# EAGLE design BT_Controller (EAGLE 8.0.0)
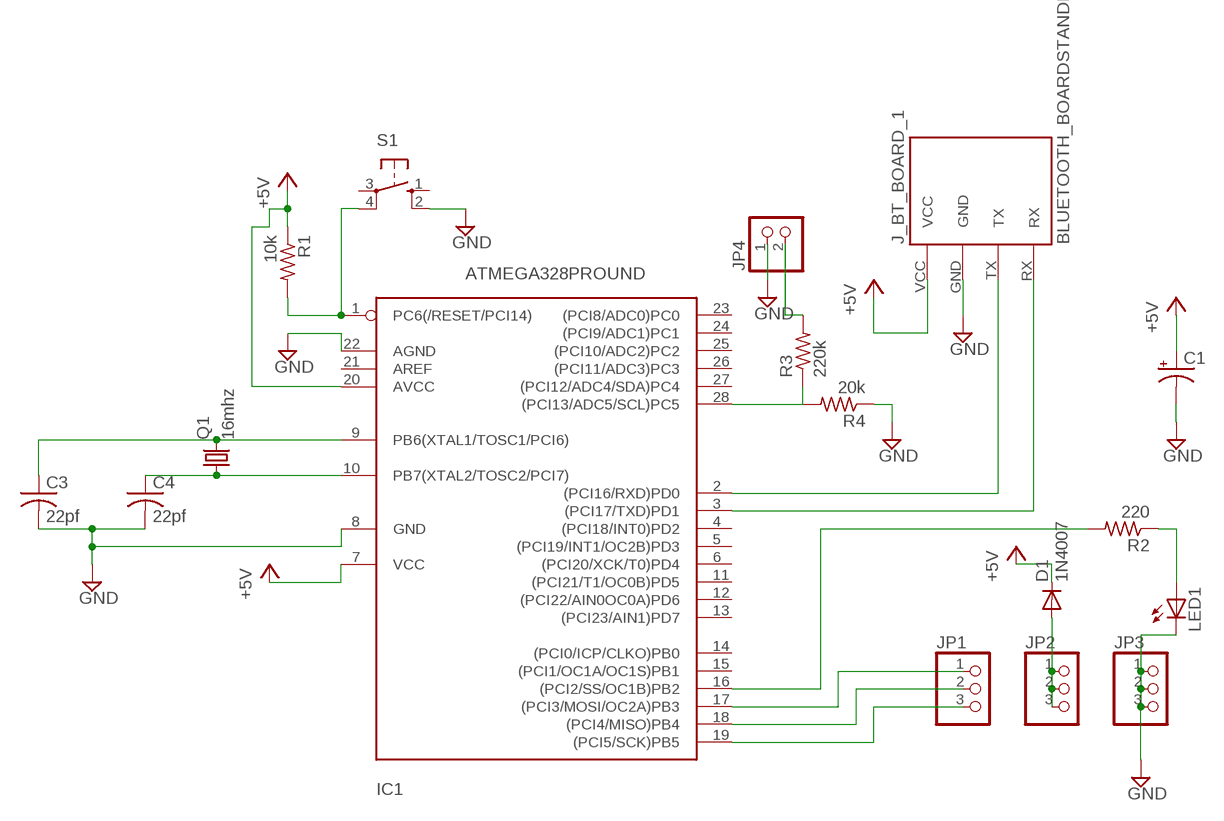
[diagram p0: schematic, sheet 1]

## Parts
C1  CPOL-USE2,5-6E  [E2,5-6E]
C3  22pf  C-US050-024X044  [C050-024X044]
C4  22pf  C-US050-024X044  [C050-024X044]
D1  1N4007  1N4004  [DO41-10]
IC1  ATMEGA328PROUND  [DIL28-3-ROUND]
J_BT_BOARD_1  BLUETOOTH_BOARDSTANDING  [BT_BOARD_FOOTPRINT_STANDING]
JP1  PINHD-1X3  [1X03]
JP2  PINHD-1X3  [1X03]
JP3  PINHD-1X3  [1X03]
JP4  PINHD-1X2  [1X02]
LED1  LED5MM  [LED5MM]
Q1  16mhz  CRYSTALHC49U70  [HC49U70]
R1  10k  R-US_0207/7  [0207/7]
R2  220  R-US_0207/7  [0207/7]
R3  220k  R-US_0207/7  [0207/7]
R4  20k  R-US_0207/7  [0207/7]
S1  10-XX  [B3F-10XX]

## Nets
+5V [supply]: C1.+ D1.C IC1.7(VCC) IC1.20(AVCC) J_BT_BOARD_1.VCC R1.1
GND [supply]: C1.- C3.2 C4.2 IC1.8(GND) IC1.22(AGND) J_BT_BOARD_1.GND JP3.1 JP3.2 JP3.3 JP4.1 LED1.K(C) R4.1 S1.2(S1)
N$1: C3.1 IC1.9(PB6(XTAL1/TOSC1/PCI6)) Q1.2
N$2: C4.1 IC1.10(PB7(XTAL2/TOSC2/PCI7)) Q1.1
N$3 [supply]: D1.A JP2.1 JP2.2 JP2.3
N$4: IC1.1(PC6(/RESET/PCI14)) R1.2 S1.4(P1)
N$5: IC1.16((PCI2/SS/OC1B)PB2) R2.2
N$6: LED1.A R2.1
N$7: IC1.17((PCI3/MOSI/OC2A)PB3) JP1.1
N$8: IC1.18((PCI4/MISO)PB4) JP1.2
N$9: IC1.19((PCI5/SCK)PB5) JP1.3
N$10: IC1.2((PCI16/RXD)PD0) J_BT_BOARD_1.TX
N$11: IC1.3((PCI17/TXD)PD1) J_BT_BOARD_1.RX
N$12: IC1.28((PCI13/ADC5/SCL)PC5) R3.1 R4.2
N$13 [supply]: JP4.2 R3.2
Unconnected: IC1.4((PCI18/INT0)PD2) IC1.5((PCI19/INT1/OC2B)PD3) IC1.6((PCI20/XCK/T0)PD4) IC1.11((PCI21/T1/OC0B)PD5) IC1.12((PCI22/AIN0OC0A)PD6) IC1.13((PCI23/AIN1)PD7) IC1.14((PCI0/ICP/CLKO)PB0) IC1.15((PCI1/OC1A/OC1S)PB1) IC1.21(AREF) IC1.23((PCI8/ADC0)PC0) IC1.24((PCI9/ADC1)PC1) IC1.25((PCI10/ADC2)PC2) IC1.26((PCI11/ADC3)PC3) IC1.27((PCI12/ADC4/SDA)PC4) S1.1(S) S1.3(P)

## Library data of the parts
C1 = resistor:CPOL-US: POLARIZED CAPACITOR, American symbol
C3 C4 = resistor:C-US: CAPACITOR, American symbol
D1 = diode:1N4004: DIODE general purpose rectifier, 1 A
IC1 = ATMEGA328:ATMEGA328*P: MICROCONTROLLER 32 kBytes FLASH 2 kBytes SRAM 1 kBytes EEPROM USART 8-channel 10 bit ADC
J_BT_BOARD_1 = HC-05:BLUETOOTH_BOARD: Bluetooth Board V1.05
JP1-JP3 = pinhead:PINHD-1X3: PIN HEADER
JP4 = pinhead:PINHD-1X2: PIN HEADER
LED1 = led:LED: LED OSRAM: - CHIPLED LG R971, LG N971, LY N971, LG Q971, LY Q971, LO R971, LY R971 LH N974, LH R974 LS Q976, LO Q976, LY Q976 LO Q996 - Hyper CHIPLED LW Q18S LB Q993, LB Q99A, LB R99A - SideLED LS A670, LO A670, LY A670, LG A670, LP A670 LB A673, LV A673, LT A673, LW A673 LH A674 LY A675 LS A676, LA A676, LO A676, LY A676, LW A676 LS A679, LY A679, LG A679 - Hyper Micro SIDELED® LS Y876, LA Y876, LO Y876, LY Y876 LT Y87S - SmartLED LW L88C, LW L88S LB L89C, LB L89S, LG L890 LS L89K, LO L89K, LY L89K LS L896, LA L896, LO L896, LY L896 - TOPLED LS T670, LO T670, LY T670, LG T670, LP T670 LSG T670, LSP T670, LSY T670, LOP T670, LYG T670 LG T671, LOG T671, LSG T671 LB T673, LV T673, LT T673, LW T673 LH T674 LS T676, LA T676, LO T676, LY T676, LB T676, LH T676, LSB T676, LW T676 LB T67C, LV T67C, LT T67C, LS T67K, LO T67K, LY T67K, LW E67C LS E67B, LA E67B, LO E67B, LY E67B, LB E67C, LV E67C, LT E67C LW T67C LS T679, LY T679, LG T679 LS T770, LO T770, LY T770, LG T770, LP T770 LB T773, LV T773, LT T773, LW T773 LH T774 LS E675, LA E675, LY E675, LS T675 LS T776, LA T776, LO T776, LY T776, LB T776 LHGB T686 LT T68C, LB T68C - Hyper Mini TOPLED® LB M676 - Mini TOPLED Santana® LG M470 LS M47K, LO M47K, LY M47K Source: http://www.osram.convergy.de LUXEON: - LUMILED® LXK2-PW12-R00, LXK2-PW12-S00, LXK2-PW14-U00, LXK2-PW14-V00 LXK2-PM12-R00, LXK2-PM12-S00, LXK2-PM14-U00 LXK2-PE12-Q00, LXK2-PE12-R00, LXK2-PE12-S00, LXK2-PE14-T00, LXK2-PE14-U00 LXK2-PB12-K00, LXK2-PB12-L00, LXK2-PB12-M00, LXK2-PB14-N00, LXK2-PB14-P00, LXK2-PB14-Q00 LXK2-PR12-L00, LXK2-PR12-M00, LXK2-PR14-Q00, LXK2-PR14-R00 LXK2-PD12-Q00, LXK2-PD12-R00, LXK2-PD12-S00 LXK2-PH12-R00, LXK2-PH12-S00 LXK2-PL12-P00, LXK2-PL12-Q00, LXK2-PL12-R00 Source: www.luxeon.com KINGBRIGHT: KA-3528ASYC Source: www.kingbright.com
Q1 = adafruit:CRYSTAL: CRYSTAL; OC_FARNELL: unknown; OC_NEWARK: unknown
R1-R4 = resistor:R-US_: RESISTOR, American symbol
S1 = switch-omron:10-XX: OMRON SWITCH; MPN: B3F-1000; OC_FARNELL: 176432; OC_NEWARK: 36M3542

## Net classes
0 default: width 0.508 mm
1 supply: width 0.762 mm

## Board
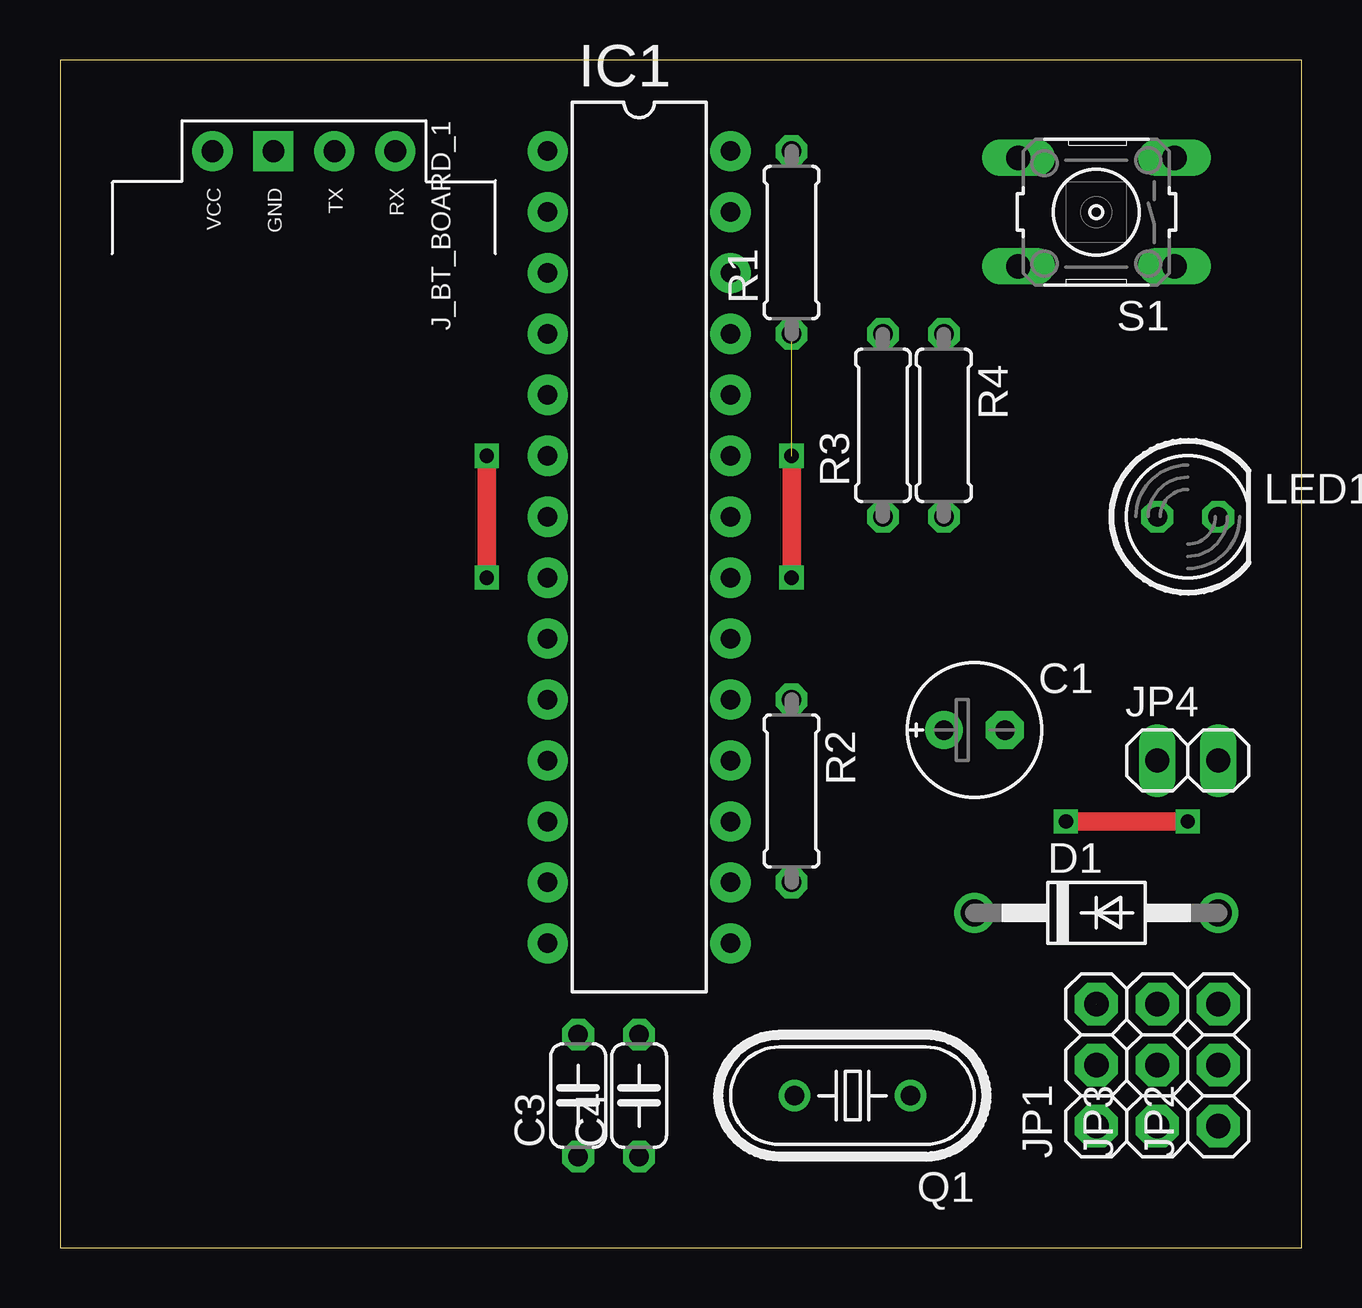
[diagram p1: board, top side]
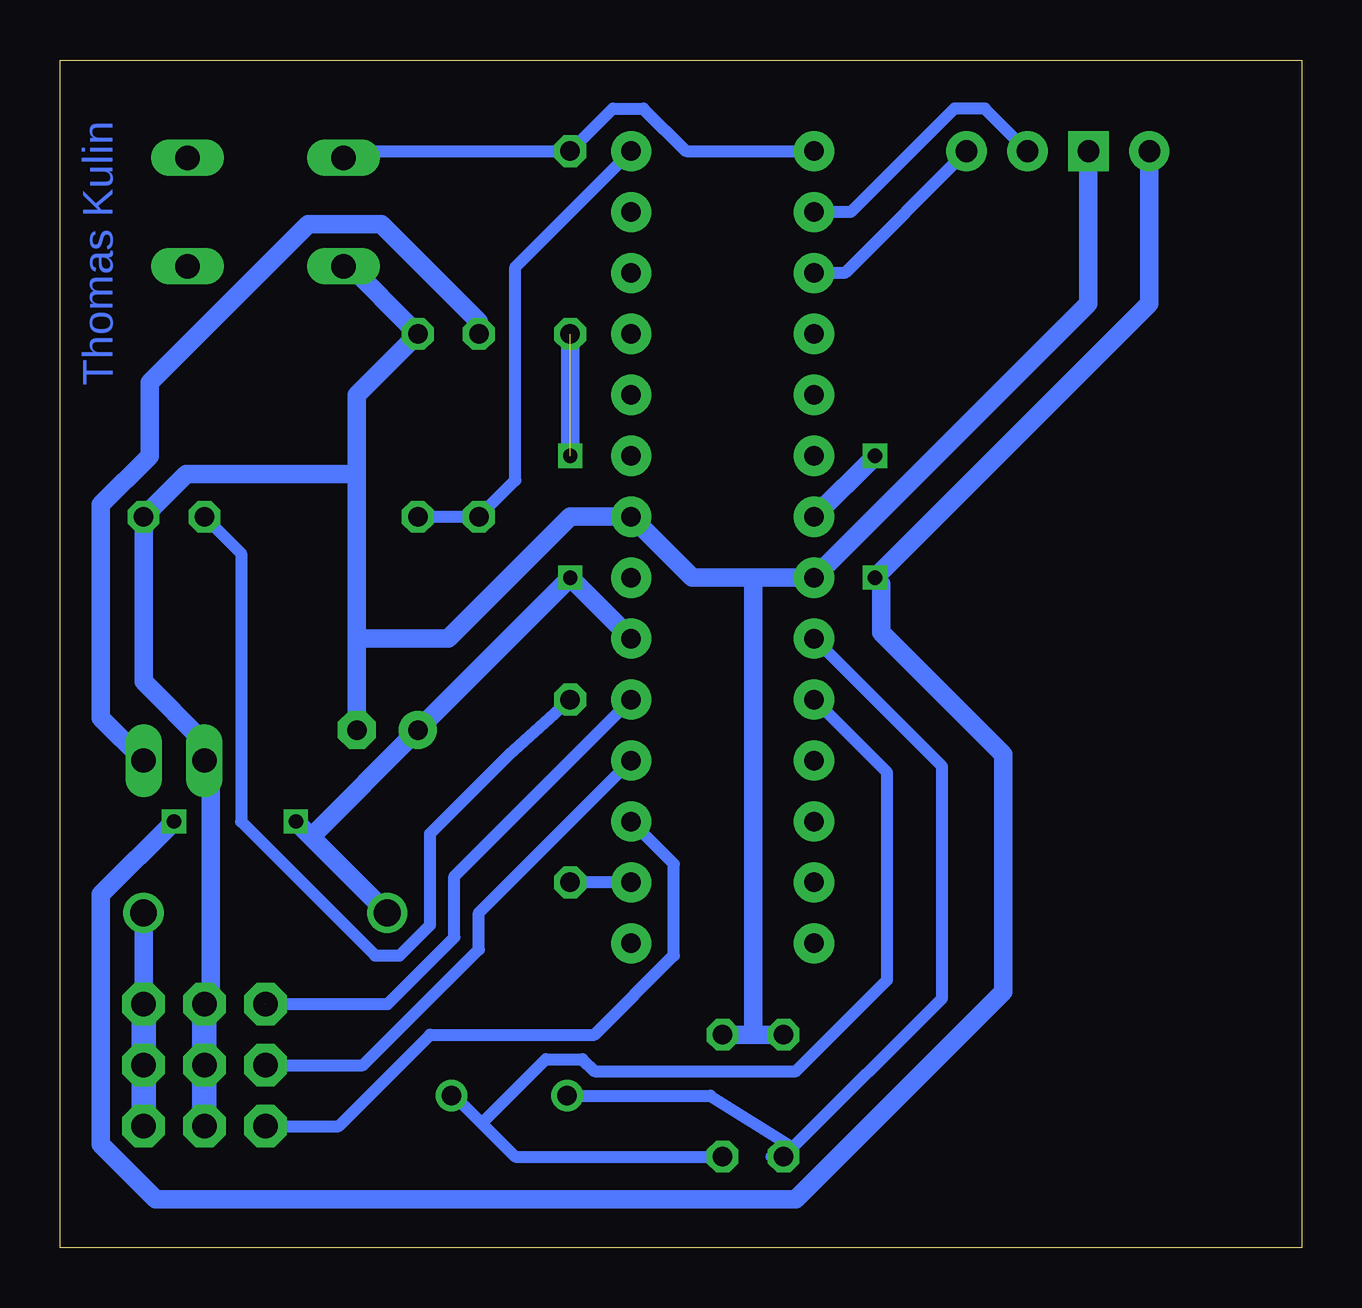
[diagram p2: board, bottom side, seen from below]

Size 51.74 x 49.52 mm. Coordinates in mm from the lower left corner, seen from the top.
Outline: 0,0 51.74,0 51.74,49.52 0,49.52 0,0
Copper layers (1*16): Top 0.035mm / dielectric 1.5mm / Bottom 0.035mm
Design rules "default *": minimum track width 10mil, minimum drill 24mil, track to track 20mil, track to pad 20mil, pad to pad 20mil, via to via 20mil, smd to smd 8mil, copper to edge 40mil, drill to drill 8mil, minimum pad ring 10mil, minimum via ring 8mil, stop-mask expansion 4mil, vias tented up to drill 0mil, thermal gap 10mil

### Footprints (pad centres in the part's own frame; a part is rotated, then mirrored left to right if it is on the bottom)
E2,5-6E = drill 0.813 pad 1.575: + -1.27,0 | drill 0.813 pad 1.575 octagon: - 1.27,0
C050-024X044 = drill 0.813 octagon: 1 -2.54,0; 2 2.54,0
DO41-10 = drill 1.118: A 5.08,0; C -5.08,0
DIL28-3-ROUND = drill 0.813 pad 1.676: 1 -16.51,-3.81; 2 -13.97,-3.81; 3 -11.43,-3.81; 4 -8.89,-3.81; 5 -6.35,-3.81; 6 -3.81,-3.81; 7 -1.27,-3.81; 8 1.27,-3.81; 9 3.81,-3.81; 10 6.35,-3.81; 11 8.89,-3.81; 12 11.43,-3.81; 13 13.97,-3.81; 14 16.51,-3.81; 15 16.51,3.81; 16 13.97,3.81; 17 11.43,3.81; 18 8.89,3.81; 19 6.35,3.81; 20 3.81,3.81; 21 1.27,3.81; 22 -1.27,3.81; 23 -3.81,3.81; 24 -6.35,3.81; 25 -8.89,3.81; 26 -11.43,3.81; 27 -13.97,3.81; 28 -16.51,3.81
BT_BOARD_FOOTPRINT_STANDING = drill 0.9 pad 1.676 square: GND -3.81,-1.27 | drill 0.9 pad 1.676: RX -3.81,3.81; TX -3.81,1.27; VCC -3.81,-3.81
1X03 = drill 1.016 pad 1.778 octagon: 1 -2.54,0; 2 0,0; 3 2.54,0
1X02 = drill 1.016 long: 1 -1.27,0; 2 1.27,0
LED5MM = drill 0.813 octagon: A -1.27,0; K 1.27,0
HC49U70 = drill 0.813: 1 -2.413,0; 2 2.413,0
0207/7 = drill 0.813 octagon: 1 -3.81,0; 2 3.81,0
B3F-10XX = drill 1.016 long: 1 -3.251,2.261; 2 3.251,2.261; 3 -3.251,-2.261; 4 3.251,-2.261

### Placement (x,y rotation side)
C1  38.1,21.59 0 top
C3  21.59,6.35 90 top
C4  24.13,6.35 90 top
D1  43.18,13.97 0 top
IC1  24.13,29.21 270 top
J_BT_BOARD_1  10.16,41.91 270 top
JP1  43.18,7.62 90 top
JP2  48.26,7.62 90 top
JP3  45.72,7.62 90 top
JP4  46.99,20.32 0 top
LED1  46.99,30.48 0 top
Q1  33.02,6.35 180 top
R1  30.48,41.91 90 top
R2  30.48,19.05 270 top
R3  34.29,34.29 90 top
R4  36.83,34.29 270 top
S1  43.18,43.18 180 top

### Tracks (layer width: path | path; a pad name or v marks a point on that pad's centre or on a via)
+5V  (via drill 0.6)  (1 unrouted)
  Top 0.762: v17.78,33.02 v17.78,27.94 | v41.91,17.78 v46.99,17.78 | v30.48,27.94 30.48,33.02
  Bottom 0.762: IC1.7 v17.78,33.02 | J_BT_BOARD_1.VCC 6.35,39.37 v17.78,27.94 17.53,27.69 17.53,25.65 12.45,20.57 12.45,10.67 21.08,2.03 47.75,2.03 50.04,4.32 50.04,14.73 v46.99,17.78 | D1.C 41.27,17.14 | 41.27,17.14 v41.91,17.78 | 41.27,17.14 C1.+ v30.48,27.94 IC1.20
GND
  Bottom 0.762: S1.2 39.88,41.15 R4.1 39.37,35.56 39.37,32.26 | 39.37,25.4 39.37,32.26 | 39.37,25.4 C1.- | JP3.1 JP3.2 JP3.3 45.47,10.41 45.47,20.07 JP4.1 45.72,21.08 48.26,23.62 LED1.K 46.48,32.26 39.37,32.26 | C4.2 22.86,8.89 | 22.86,8.89 C3.2 | 22.86,27.94 25.4,27.94 IC1.22 30.48,30.48 35.56,25.4 39.37,25.4 | 22.86,27.94 IC1.8 8.89,39.37 J_BT_BOARD_1.GND | 22.86,27.94 22.86,8.89
  Bottom 1.016: JP3.3 JP3.1
N$1
  Bottom 0.508: C3.1 22.1,3.81 21.21,4.19 | 21.21,4.19 24.64,6.35 Q1.2 | IC1.9 14.99,20.07 14.99,10.41 21.21,4.19
N$2
  Bottom 0.508: C4.1 32.77,3.81 34.16,5.21 | 34.16,5.21 35.31,6.35 Q1.1 | IC1.10 17.27,19.81 17.27,11.18 21.08,7.37 29.46,7.37 29.97,7.87 31.5,7.87 34.16,5.21
N$3
  Bottom 0.762: JP2.1 JP2.2 JP2.3 D1.A
  Bottom 1.016: JP2.3 JP2.1
N$4
  Bottom 0.508: S1.4 39.88,45.47 39.62,45.72 R1.2 28.7,47.5 27.43,47.5 25.65,45.72 IC1.1
N$5
  Bottom 0.508: IC1.16 R2.2
N$6
  Bottom 0.508: R2.1 33.02,20.57 36.32,17.27 36.32,13.46 37.59,12.19 38.61,12.19 44.2,17.78 44.2,28.96 LED1.A
N$7
  Bottom 0.508: IC1.17 26.16,16 26.16,12.19 29.46,8.89 36.32,8.89 40.13,5.08 JP1.1
N$8
  Bottom 0.508: IC1.18 34.29,13.97 34.29,12.45 39.12,7.62 JP1.2
N$9  (1 unrouted)
  Bottom 0.508: IC1.19 35.31,15.49 35.31,12.95 38.1,10.16 JP1.3
N$10
  Bottom 0.508: IC1.2 18.8,43.18 14.48,47.5 13.21,47.5 J_BT_BOARD_1.TX
N$11
  Bottom 0.508: IC1.3 19.05,40.64 J_BT_BOARD_1.RX
N$12
  Bottom 0.508: R4.2 R3.1 32.77,32 32.77,40.89 IC1.28
N$13
  Bottom 0.762: R3.2 34.29,38.61 38.35,42.67 41.4,42.67 48.01,36.07 48.01,33.02 50.04,30.99 50.04,22.1 JP4.2
N$14  (via drill 0.6)
  Bottom 0.762: v30.48,33.02 30.48,38.1

### Text on the board
Bottom: Thomas Kulin